# EAGLE design adc (EAGLE 7.4.0)
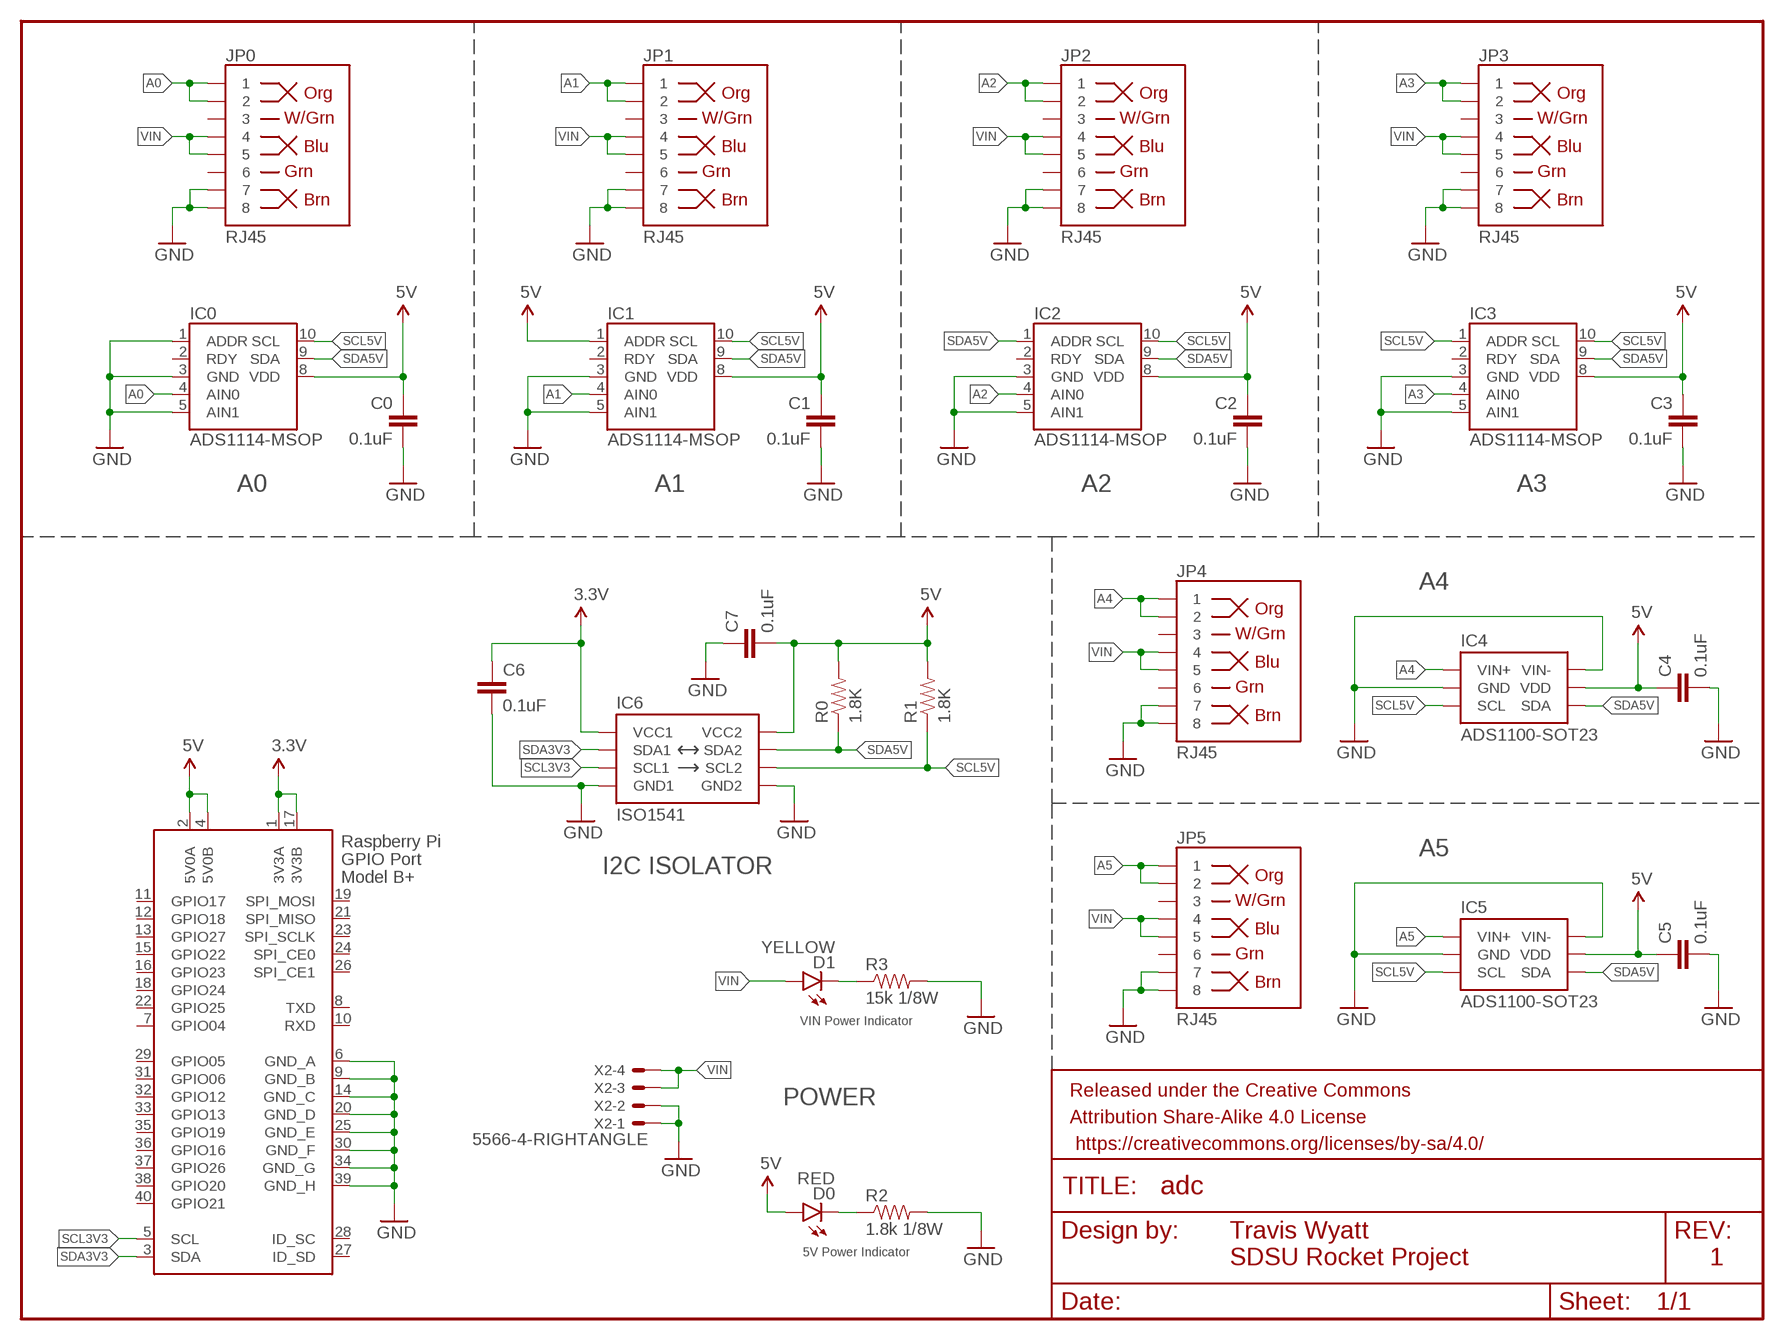
[diagram p0: schematic, sheet 1]

## Parts
C0  0.1uF  CAP0603-CAP  [0603-CAP]
C1  0.1uF  CAP0603-CAP  [0603-CAP]
C2  0.1uF  CAP0603-CAP  [0603-CAP]
C3  0.1uF  CAP0603-CAP  [0603-CAP]
C4  0.1uF  CAP0603-CAP  [0603-CAP]
C5  0.1uF  CAP0603-CAP  [0603-CAP]
C6  0.1uF  CAP0603-CAP  [0603-CAP]
C7  0.1uF  CAP0603-CAP  [0603-CAP]
D0  RED  LED0603  [LED-0603]
D1  YELLOW  LED0603  [LED-0603]
FRAME1  FRAME-LETTER  [CREATIVE_COMMONS]
IC0  ADS1114-MSOP  [MSOP10]
IC1  ADS1114-MSOP  [MSOP10]
IC2  ADS1114-MSOP  [MSOP10]
IC3  ADS1114-MSOP  [MSOP10]
IC4  ADS1100-SOT23  [SOT23-6]
IC5  ADS1100-SOT23  [SOT23-6]
IC6  ISO1541  ISO1541-SOIC  [SOIC8]
JP0  RJ45  RJ45-8PTH  [RJ45-8]
JP1  RJ45  RJ45-8PTH  [RJ45-8]
JP2  RJ45  RJ45-8PTH  [RJ45-8]
JP3  RJ45  RJ45-8PTH  [RJ45-8]
JP4  RJ45  RJ45-8PTH  [RJ45-8]
JP5  RJ45  RJ45-8PTH  [RJ45-8]
R0  1.8K  RESISTOR0603-RES  [0603-RES]
R1  1.8K  RESISTOR0603-RES  [0603-RES]
R2  1.8k 1/8W  RESISTOR0603-RES  [0603-RES]
R3  15k 1/8W  RESISTOR0603-RES  [0603-RES]
X1  RASPI_BOARD_B+#_H  [RASPI_BOARD_B+HAT]
X2  5566-4-RIGHTANGLE  [5566-4]

## Nets
3.3V: C6.1 IC6.1(VCC1) X1.1(3V3A) X1.17(3V3B)
5V: C0.1 C1.1 C2.1 C3.1 C4.1 C5.1 C7.2 D0.A IC0.8(VDD) IC1.1(ADDR) IC1.8(VDD) IC2.8(VDD) IC3.8(VDD) IC4.5(VDD) IC5.5(VDD) IC6.8(VCC2) R0.2 R1.2 X1.2(5V0A) X1.4(5V0B)
A0: IC0.4(AIN0) JP0.1 JP0.2
A1: IC1.4(AIN0) JP1.1 JP1.2
A2: IC2.4(AIN0) JP2.1 JP2.2
A3: IC3.4(AIN0) JP3.1 JP3.2
A4: IC4.1(VIN+) JP4.1 JP4.2
A5: IC5.1(VIN+) JP5.1 JP5.2
GND: C0.2 C1.2 C2.2 C3.2 C4.2 C5.2 C6.2 C7.1 IC0.1(ADDR) IC0.3(GND) IC0.5(AIN1) IC1.3(GND) IC1.5(AIN1) IC2.3(GND) IC2.5(AIN1) IC3.3(GND) IC3.5(AIN1) IC4.2(GND) IC4.6(VIN-) IC5.2(GND) IC5.6(VIN-) IC6.4(GND1) IC6.5(GND2) JP0.7 JP0.8 JP1.7 JP1.8 JP2.7 JP2.8 JP3.7 JP3.8 JP4.7 JP4.8 JP5.7 JP5.8 R2.2 R3.2 X1.6(GND_A) X1.9(GND_B) X1.14(GND_C) X1.20(GND_D) X1.25(GND_E) X1.30(GND_F) X1.34(GND_G) X1.39(GND_H) X2.1 X2.2
N$1: D1.C R3.1
N$4: D0.C R2.1
SCL3V3: IC6.3(SCL1) X1.5(SCL)
SCL5V: IC0.10(SCL) IC1.10(SCL) IC2.10(SCL) IC3.1(ADDR) IC3.10(SCL) IC4.3(SCL) IC5.3(SCL) IC6.6(SCL2) R1.1
SDA3V3: IC6.2(SDA1) X1.3(SDA)
SDA5V: IC0.9(SDA) IC1.9(SDA) IC2.1(ADDR) IC2.9(SDA) IC3.9(SDA) IC4.4(SDA) IC5.4(SDA) IC6.7(SDA2) R0.1
VIN: D1.A JP0.4 JP0.5 JP1.4 JP1.5 JP2.4 JP2.5 JP3.4 JP3.5 JP4.4 JP4.5 JP5.4 JP5.5 X2.3 X2.4
Unconnected: IC0.2(RDY) IC1.2(RDY) IC2.2(RDY) IC3.2(RDY) JP0.3 JP0.6 JP1.3 JP1.6 JP2.3 JP2.6 JP3.3 JP3.6 JP4.3 JP4.6 JP5.3 JP5.6 X1.7(GPIO04) X1.8(TXD) X1.10(RXD) X1.11(GPIO17) X1.12(GPIO18) X1.13(GPIO27) X1.15(GPIO22) X1.16(GPIO23) X1.18(GPIO24) X1.19(SPI_MOSI) X1.21(SPI_MISO) X1.22(GPIO25) X1.23(SPI_SCLK) X1.24(SPI_CE0) X1.26(SPI_CE1) X1.27(ID_SD) X1.28(ID_SC) X1.29(GPIO05) X1.31(GPIO06) X1.32(GPIO12) X1.33(GPIO13) X1.35(GPIO19) X1.36(GPIO16) X1.37(GPIO26) X1.38(GPIO20) X1.40(GPIO21)

## Notes on the sheet
- A0 | A1 | A2 | A3
- A4
- A5
- I2C ISOLATOR
- VIN Power Indicator
- POWER
- Travis Wyatt
- 5V Power Indicator
- SDSU Rocket Project
- 1

## Library data of the parts
C0 C1-C7 = SparkFun-Capacitors:CAP: Capacitor Standard 0603 ceramic capacitor, and 0.1" leaded capacitor.
D0 D1 = SparkFun-LED:LED: LEDs Standard schematic elements and footprints for 5mm, 3mm, 1206, and 0603 sized LEDs. 5mm - Spark Fun Electronics SKU : COM-00529 (and others)
FRAME1 = SparkFun-Aesthetics:FRAME-LETTER: Schematic Frame Standard 8.5x11 US Letter frame
IC0 IC1-IC3 = SDSURocket-DigitalIC:ADS1114: ADS1114 Ultra-Small, Low-Power, 16-Bit Analog-to-Digital Converter with Internal Reference
IC4 IC5 = SDSURocket-DigitalIC:ADS1100: Self-Calibrating, 16-Bit Analog-to-Digital Converter
IC6 = SDSURocket-DigitalIC:ISO1541: Low-Power Bidirectional I2C Isolator
JP0 JP1-JP5 = SparkFun-Connectors:RJ45-8: RJ45 Jack Simple RJ45, 8-pin connection - connector for common Cat5, Cat5e, and Cat6 Ethernet cables. Footprint not yet proven in production. Connector sku is PRT-00643; Breakout PCB sku is BOB-00716.; PROD_ID: CONN-08506
R0 R1 = SparkFun-Passives:RESISTOR: Resistor Basic schematic elements and footprints for 0603, 1206, and PTH resistors.
R2 R3 = SparkFun-Resistors:RESISTOR: Resistor Basic schematic elements and footprints for 0603, 1206, and PTH resistors.
X1 = raspberrypi_bastelstube_v13:RASPI_BOARD_B+#: Raspberry Pi GPIO connector with markings for the outer dimensions of the Raspberry Pi board model B+ with different sets of drill holes or mounting pads All pins connected
X2 = SDSURocket-Connectors:5566-4: Mini FIT connector 4 pol Source: http://www.molex.com; OC_FARNELL: unknown; OC_NEWARK: unknown

## Net classes
1 5V Power: width 0.61 mm

## Board
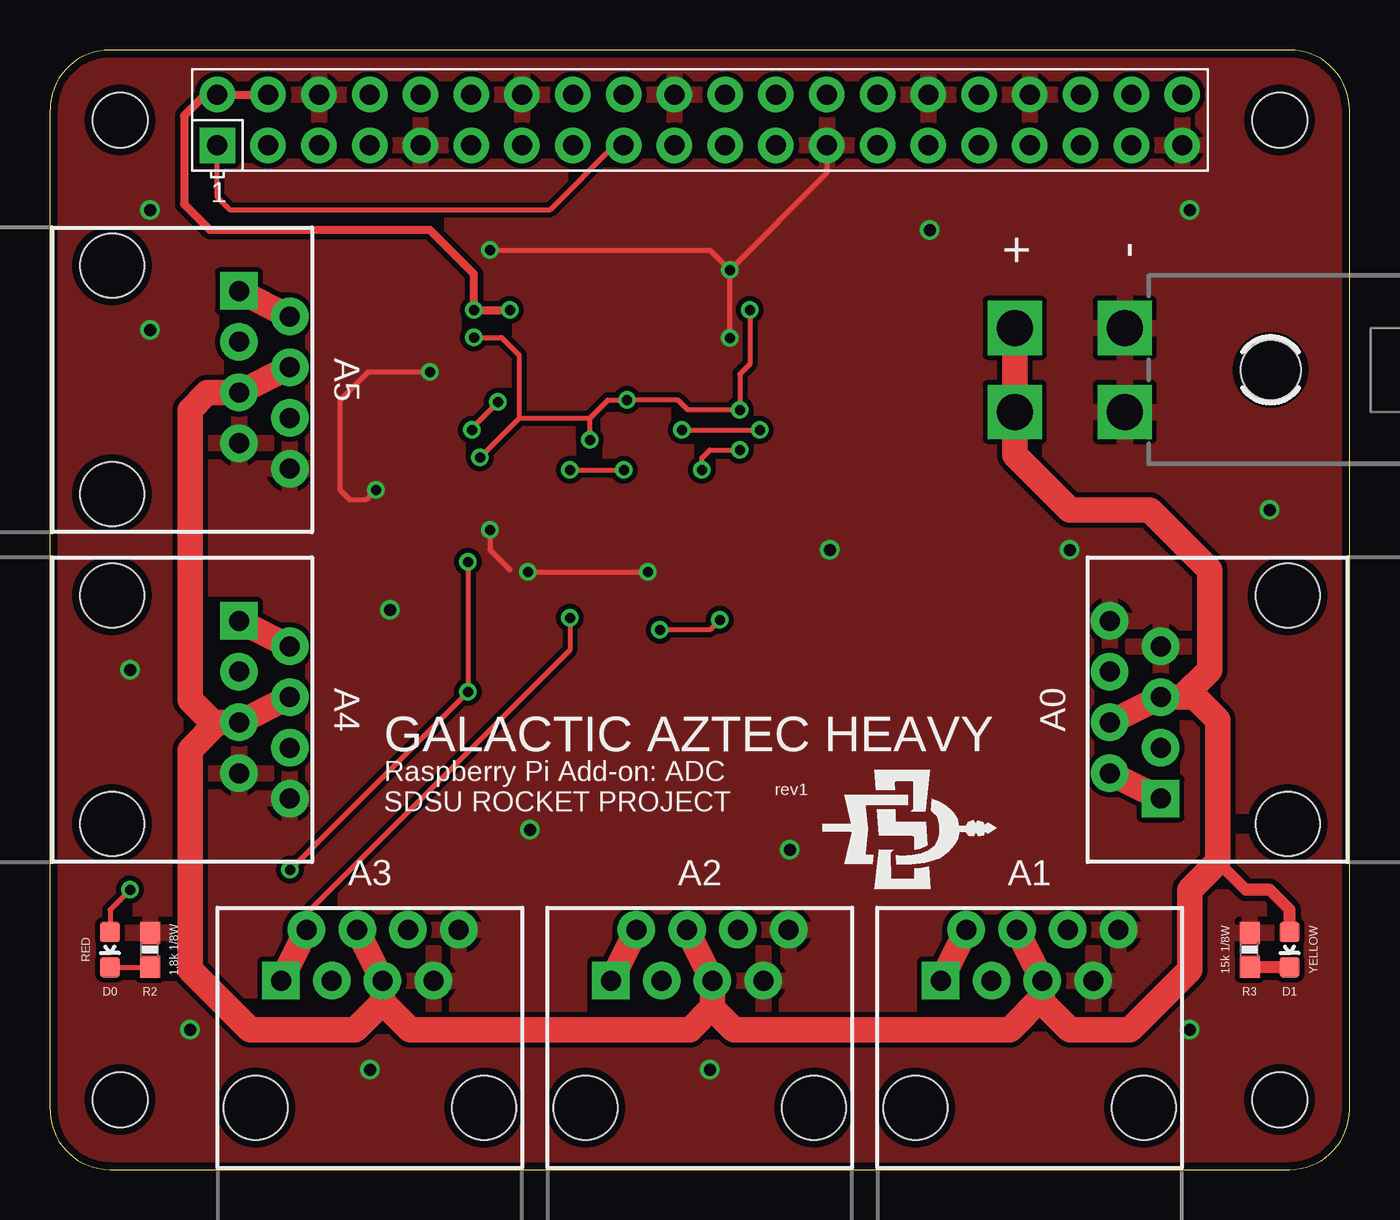
[diagram p1: board, top side]
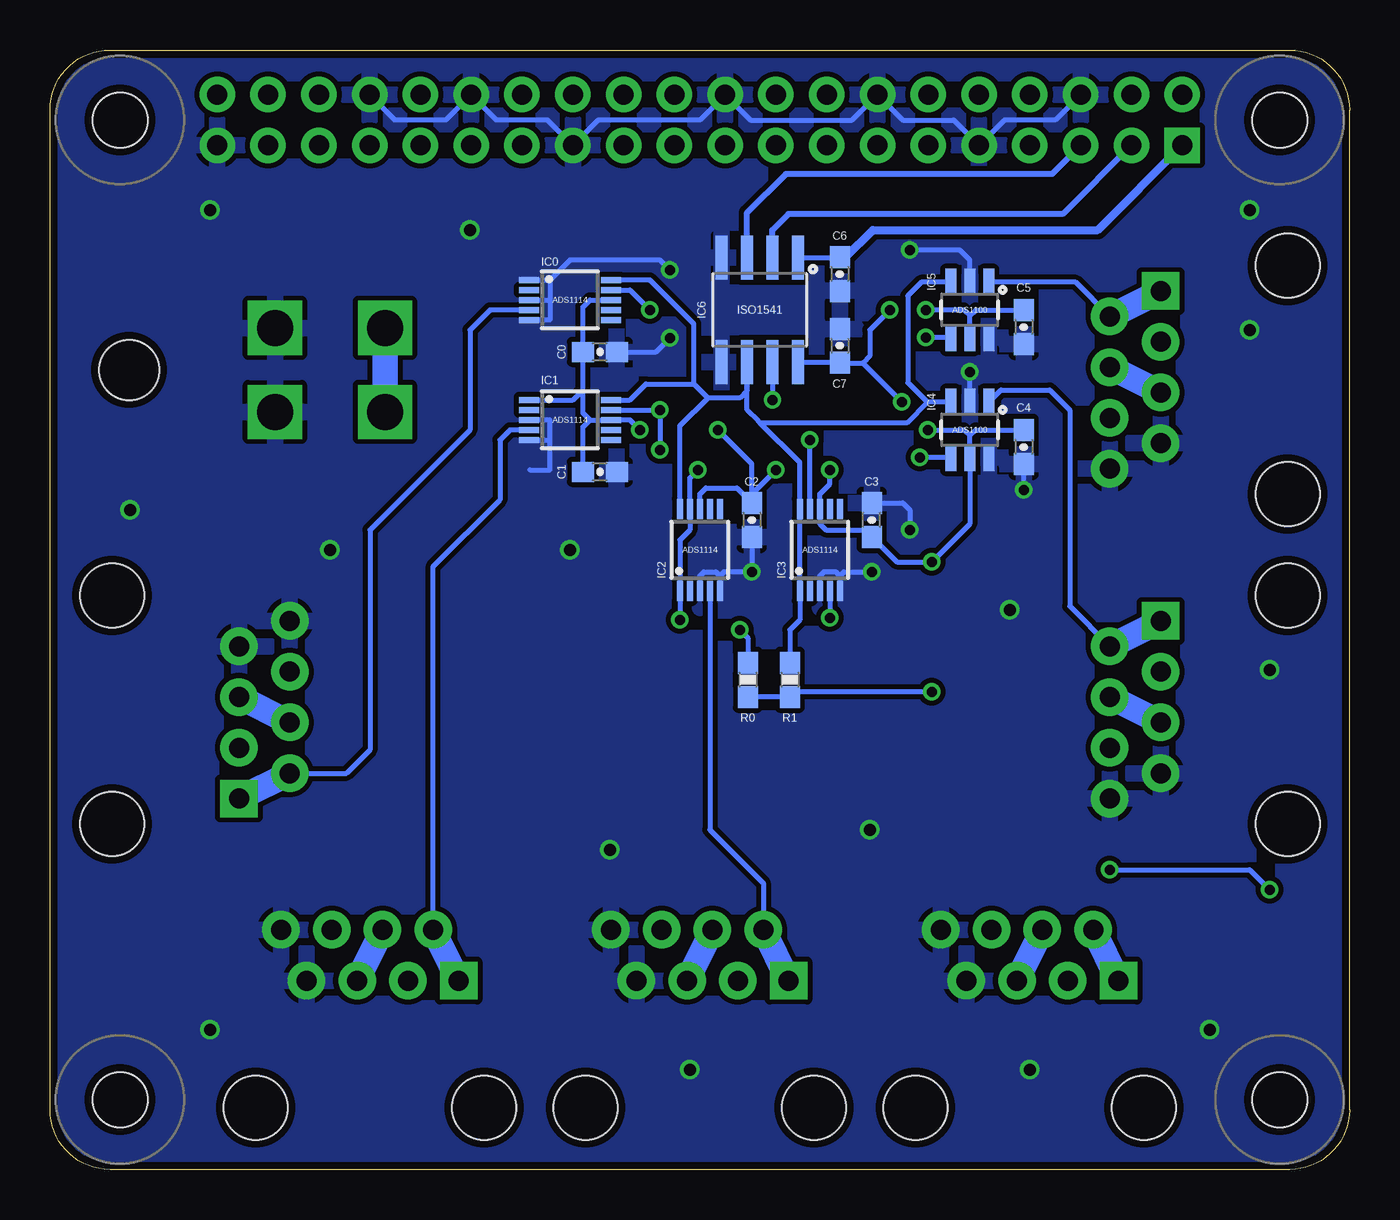
[diagram p2: board, bottom side, seen from below]

Size 65 x 56 mm. Coordinates in mm from the lower left corner, seen from the top.
Copper layers (1*16): Top 0.0356mm / dielectric 1.5011mm / Bottom 0.0356mm
Design rules "SparkFunBestPractices": minimum track width 10mil, minimum drill 13mil, track to track 10mil, track to pad 10mil, pad to pad 10mil, via to via 10mil, smd to smd 10mil, copper to edge 15mil, drill to drill 12mil, minimum pad ring 7mil, minimum via ring 7mil, stop-mask expansion 3mil, vias tented up to drill 0mil, thermal gap 10mil

### Footprints (pad centres in the part's own frame; a part is rotated, then mirrored left to right if it is on the bottom)
0603-CAP = smd 1.1 x 1: 1 -0.85,0; 2 0.85,0
LED-0603 = smd 1 x 1: A 0,-0.877; C 0,0.877
MSOP10 = smd 0.3 x 1: 1 -1,-2.05; 2 -0.5,-2.05; 3 0,-2.05; 4 0.5,-2.05; 5 1,-2.05; 6 1,2.05; 7 0.5,2.05; 8 0,2.05; 9 -0.5,2.05; 10 -1,2.05
SOT23-6 = smd 0.55 x 1.35: 1 -0.95,-1.375; 2 0,-1.375; 3 0.95,-1.375; 4 0.95,1.375; 5 0,1.375; 6 -0.95,1.375
SOIC8 = smd 0.61 x 2.21: 1 -1.905,-2.616; 2 -0.635,-2.616; 3 0.635,-2.616; 4 1.905,-2.616; 5 1.905,2.616; 6 0.635,2.616; 7 -0.635,2.616; 8 -1.905,2.616
RJ45-8 = drill 1 pad 1.88 square: 1 -4.445,6.35 | drill 1 pad 1.88: 2 -3.175,8.89; 3 -1.905,6.35; 4 -0.635,8.89; 5 0.635,6.35; 6 1.905,8.89; 7 3.175,6.35; 8 4.445,8.89 | hole 3.2: -5.715,0; 5.715,0
0603-RES = smd 1.1 x 1: 1 -0.85,0; 2 0.85,0
RASPI_BOARD_B+HAT = drill 1 pad 1.778 square: 1 8.37,51.23 | drill 1 pad 1.778: 2 8.37,53.77; 3 10.91,51.23; 4 10.91,53.77; 5 13.45,51.23; 6 13.45,53.77; 7 15.99,51.23; 8 15.99,53.77; 9 18.53,51.23; 10 18.53,53.77; 11 21.07,51.23; 12 21.07,53.77; 13 23.61,51.23; 14 23.61,53.77; 15 26.15,51.23; 16 26.15,53.77; 17 28.69,51.23; 18 28.69,53.77; 19 31.23,51.23; 20 31.23,53.77; 21 33.77,51.23; 22 33.77,53.77; 23 36.31,51.23; 24 36.31,53.77; 25 38.85,51.23; 26 38.85,53.77; 27 41.39,51.23; 28 41.39,53.77; 29 43.93,51.23; 30 43.93,53.77; 31 46.47,51.23; 32 46.47,53.77; 33 49.01,51.23; 34 49.01,53.77; 35 51.55,51.23; 36 51.55,53.77; 37 54.09,51.23; 38 54.09,53.77; 39 56.63,51.23; 40 56.63,53.77 | hole 2.75: 3.5,3.5; 3.5,52.5; 61.5,3.5; 61.5,52.5
5566-4 = drill 1.8 square: 1 2.1,-2.75; 2 -2.1,-2.75; 3 2.1,2.75; 4 -2.1,2.75 | hole 3: 0,-10.05

### Placement (x,y rotation side)
C0  37.5,40.9 0 bottom
C1  37.5,34.9 0 bottom
C2  29.9,32.5 270 bottom
C3  23.9,32.5 90 bottom
C4  16.3,36.15 270 bottom
C5  16.3,42.15 270 bottom
C6  25.5,44.8 270 bottom
C7  25.5,41.2 270 bottom
D0  3,11 180 top
D1  62,11 180 top
FRAME1  0,-16 0 top  (outside the outline)
IC0  39,43.5 270 bottom
IC1  39,37.5 270 bottom
IC2  32.5,31 0 bottom
IC3  26.5,31 0 bottom
IC4  19,37 180 bottom
IC5  19,43 180 bottom
IC6  29.5,43 180 bottom
JP0  61.9,23 90 top
JP1  49,3.1 0 top
JP2  32.5,3.1 0 top
JP3  16,3.1 0 top
JP4  3.1,23 270 top
JP5  3.1,39.5 270 top
R0  30.1,24.5 270 bottom
R1  28,24.5 270 bottom
R2  5,11 90 top
R3  60,11 90 top
X1  0,0 0 top
X2  51,40 90 top

### Tracks (layer width: path | path; a pad name or v marks a point on that pad's centre or on a via)
3.3V
  Top 0.254: X1.17 28.23,51.23 25,48 9,48 8.37,48.63 X1.1
  Bottom 0.254: IC6.1 25.23,45.62 C6.1
  Bottom 0.406: 25.35,45.65 C6.1 | 25.23,45.62 23.85,47 12.6,47 X1.1
5V  (via drill 0.5)
  Top 0.254: v4,14 3,13 D0.A | v22.4,38.4 21.1,37.1 v21.1,37 | v31.6,37 v35.5,37 | v26,35 v28.7,35 | v20.9,30.4 v20.9,23.9 v12,15
  Top 0.406: v23,43 v21.2,43 21.2,44.8 19,47 8,47 6.7,48.3 6.7,52.7 7.77,53.77 X1.2 X1.4
  Bottom 0.254: IC6.8 25.23,40.38 C7.2 24.35,40.35 | 19,42.7 18.7,43 C5.1 | C4.1 18.7,37 19,36.7 | C1.1 38.35,37.15 38,37.5 | 38,37.5 IC1.8 36,37.5 v35.5,37 | IC0.8 38,43.5 38.35,43.15 C0.1 38.35,39 | 38,37.5 38.35,37.85 38.35,39 | IC1.1 38.85,38.5 38.35,39 | v12,15 5,15 v4,14 | IC5.5 19,42.7 | 19,42.7 19.3,43 v21.2,43 | v23,43 24,42 24,40.7 24.35,40.35 | 24.35,40.35 v22.4,38.4 | v21.1,37 19.3,37 19,36.7 | 19,36.7 IC4.5 19,32.3 v20.9,30.4 22.65,30.4 C3.1 24.25,32 26.2,32 26.5,32.3 IC3.8 26.5,33.8 26,34.3 v26,35 | IC2.8 32.5,33.8 32.2,34.1 30.65,34.1 C2.1 | C2.1 29.9,35.3 v31.6,37 | R0.2 R1.2 27.75,23.9 v20.9,23.9 | v28.7,35 29.9,33.8 C2.1
A0
  Top 1.27: JP0.2 JP0.1
  Bottom 0.254: IC0.4 43,43 44,42 44,37 49,32 49,21 50.17,19.82 JP0.2
  Bottom 1.27: JP0.2 JP0.1
A1
  Top 1.27: JP1.2 JP1.1
  Bottom 0.254: IC1.4 42,37 42.5,36.5 42.5,33.5 45.83,30.18 JP1.2
  Bottom 1.27: JP1.1 JP1.2
A2
  Top 1.27: JP2.2 JP2.1
  Bottom 0.254: IC2.4 32,17 29.32,14.32 JP2.2
  Bottom 1.27: JP2.1 JP2.2
A3  (via drill 0.5)
  Top 0.254: v26,27.6 26,26 12.82,12.82 JP3.2
  Top 1.27: JP3.2 JP3.1
  Bottom 0.254: IC3.4 v26,27.6
  Bottom 1.27: JP3.1 JP3.2
A4
  Top 1.27: JP4.2 JP4.1
  Bottom 0.254: IC4.1 17.43,39 15,39 14,38 14,28.18 JP4.2
  Bottom 1.27: JP4.1 JP4.2
A5
  Top 1.27: JP5.2 JP5.1
  Bottom 0.254: JP5.2 13.69,44.38 IC5.1
  Bottom 1.27: JP5.1 JP5.2
GND  (via drill 0.5, 0.6)
  Top 0.254: v22,32 22,31 23,30 | v23.9,29.9 v29.9,29.9 | v34,41.6 v34,45 | v22,46 33,46 v34,45 | v19,39.9 15.9,39.9 14.5,38.5 14.5,34 15,33.5 15.8,33.5 v16.3,34 | X1.25 38.85,49.85 v34,45
  Bottom 0.254: IC1.5 40,36.5 | 40,36.5 40,37.5 IC1.3 | 41,42.5 IC0.5 40,42.5 40,43.5 | JP3.8 | IC0.1 40,44.5 | 40,44.5 40,43.5 | IC0.3 40,43.5 | 41,35 40,35 40,36.5 | IC4.2 v19,39.9 | 24,33.45 C3.2 22.35,33.35 22,33 v22,32 | IC2.5 31.5,29.7 | 31.5,29.7 31.7,29.9 32.3,29.9 32.5,29.7 IC2.3 | IC3.3 26.5,29.7 26.3,29.9 25.7,29.9 25.5,29.7 | 25.5,29.7 IC3.5 | 25.5,29.7 25.3,29.9 v23.9,29.9 | C2.2 v29.9,29.9 | 30,29.9 31.3,29.9 31.5,29.7 | C0.2 34.7,40.9 v34,41.6 | v34,45 34.5,45.5 39,45.5 40,44.5 | X1.34 47.74,52.5 45.2,52.5 X1.30 42.66,52.5 40.12,52.5 X1.25 37.58,52.5 32.5,52.5 X1.20 29.96,52.5 24.88,52.5 X1.14 22.34,52.5 19.8,52.5 X1.9 17.26,52.5 14.72,52.5 X1.6 | IC5.2 19,45.5 19.5,46 v22,46 | v16.3,34 C4.2
  other vias: 7,7 57,7 57,48 5,48 17,28 39,31 37,16 24,17 51,31 61,33 44,47 33,5 16,5 4,25 5,42
  pour Bottom: 0,0 65,0 65,56 0,56
  pour Top: 0,0 65,0 65,56 0,56
N$1
  Top 0.61: D1.C 60.03,10.12 R3.1
N$4
  Top 0.254: D0.C 4.97,10.12 R2.1
SCL3V3
  Bottom 0.305: IC6.3 30.14,47.87 28.2,49.8 14.88,49.8 X1.5
SCL5V
  Bottom 0.254: IC0.10 35,44.5 32.8,42.3 32.8,39.3 | IC4.3 21.12,38.38 | IC5.3 21.43,44.38 22.1,43.7 22.1,39.35 21.12,38.38 | IC1.10 36,38.5 35.2,39.3 32.8,39.3 | IC2.10 33.5,37.2 32.1,38.6 | 32.1,38.6 30.5,38.6 30.14,38.97 IC6.6 30.14,38 29.57,37.43 29.48,37.35 | 32.1,38.6 32.8,39.3 | 21.12,38.38 22.15,37.35 29.48,37.35 | R1.1 28,27 27.5,27.5 IC3.1 IC3.10 27.5,35.37 29.48,37.35
SDA3V3
  Bottom 0.305: X1.3 14.34,47.8 28.07,47.8 28.86,47 IC6.2
SDA5V  (via drill 0.5)
  Top 0.254: v21.5,35.62 23.48,37.6 | 23.48,37.6 23.48,40.73 22.57,41.62 v21.2,41.62 | 23.48,37.6 27,37.6 | v35,43 35,40.3 34.5,39.8 v34.5,38 31.9,38 31.4,38.5 v28.86,38.5 27.9,38.5 27,37.6 | v27,36.5 27,37.6 | v32.6,35 32.6,35.6 33,36 v34.5,36 | v33.5,27.5 33,27 v30.5,27
  Bottom 0.254: IC0.9 36,44 v35,43 | IC4.4 v21.5,35.62 | IC5.4 v21.2,41.62 | IC3.9 v27,36.5 | IC1.9 v34.5,38 v34.5,36 | IC6.7 v28.86,38.5 | v32.6,35 33,34.6 IC2.9 33,32 33.5,31.5 IC2.1 v33.5,27.5 | v30.5,27 30.1,26.6 R0.1
VIN
  Top 0.61: D1.A 62,13 61,14 59.8,14 58.4,15.4
  Top 1.27: X2.3 X2.4 48.25,35.75 51,33 55,33 58,30 58,25 56.63,23.64 JP0.5 | JP0.5 JP0.4 | JP1.4 JP1.5 49.63,8.63 | JP2.4 JP2.5 | JP3.4 JP3.5 16.64,8.37 | JP4.5 JP4.4 | JP5.4 JP5.5 7.87,38.87 7,38 7,23.5 8.13,22.36 JP4.5 | 16.64,8.37 18,7 32,7 33.13,8.13 JP2.5 | JP2.5 33.13,8.06 34.2,7 48,7 49.63,8.63 | 49.63,8.63 49.63,8.37 51,7 54,7 57,10 57,14 58.4,15.4 58.4,22.5 57.27,23.64 JP0.5 | JP4.5 8.37,22.36 7,21 7,10 10,7 15.27,7 16.64,8.37
  Bottom 1.27: JP1.4 JP1.5 | JP0.4 JP0.5 | JP3.4 JP3.5 | JP4.5 JP4.4 | JP5.5 JP5.4 | X2.4 X2.3 | JP2.5 JP2.4

### Text on the board
tNames: + | - | A5 | A4 | A0 | GALACTIC AZTEC HEAVY | Raspberry Pi Add-on: ADC | rev1 | SDSU ROCKET PROJECT | A3 | A2 | A1
bNames: ADS1114 | ADS1100 | ADS1114 | ADS1100 | ADS1114 | ADS1114